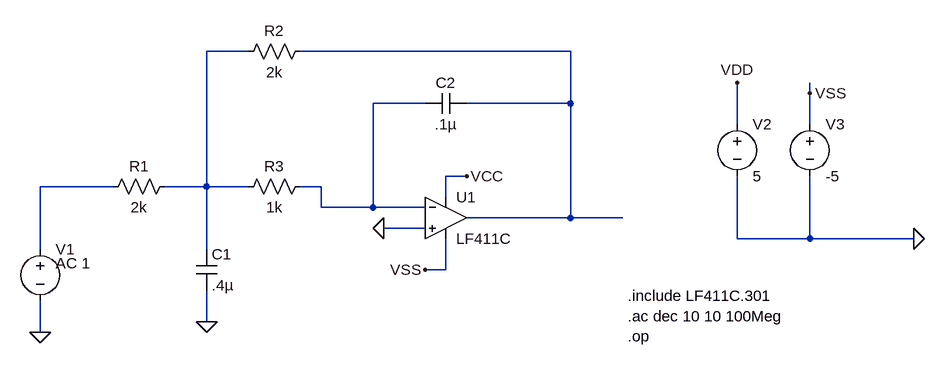
[diagram p0: schematic Draft15.asc]
Draft15.asc, the LTspice schematic file:
Version 4
SHEET 1 1120 680
WIRE 80 96 16 96
WIRE 576 96 160 96
WIRE 944 160 944 144
WIRE 352 176 272 176
WIRE 576 176 576 96
WIRE 576 176 416 176
WIRE 832 208 832 144
WIRE 944 208 944 160
WIRE 416 288 384 288
WIRE -128 304 -240 304
WIRE 16 304 16 96
WIRE 16 304 -48 304
WIRE 80 304 16 304
WIRE 192 304 160 304
WIRE 384 320 384 288
WIRE 192 336 192 304
WIRE 272 336 272 176
WIRE 272 336 192 336
WIRE 352 336 272 336
WIRE 576 352 576 176
WIRE 576 352 416 352
WIRE 656 352 576 352
WIRE 352 368 288 368
WIRE 832 384 832 288
WIRE 944 384 944 288
WIRE 944 384 832 384
WIRE 1104 384 944 384
WIRE -240 400 -240 304
WIRE 16 400 16 304
WIRE 384 432 384 384
WIRE 384 432 352 432
WIRE 16 512 16 464
WIRE -240 528 -240 480
FLAG 416 288 VCC
FLAG 352 432 VSS
FLAG 16 512 0
FLAG -240 528 0
FLAG 288 368 0
FLAG 944 160 VSS
FLAG 832 144 VDD
FLAG 1104 384 0
SYMBOL voltage -240 384 R0
WINDOW 123 24 38 Left 2
SYMATTR InstName V1
SYMATTR Value ""
SYMATTR Value2 AC 1
SYMBOL res -32 288 R90
WINDOW 0 0 56 VBottom 2
WINDOW 3 32 56 VTop 2
SYMATTR InstName R1
SYMATTR Value 2k
SYMBOL res 176 80 R90
WINDOW 0 0 56 VBottom 2
WINDOW 3 32 56 VTop 2
SYMATTR InstName R2
SYMATTR Value 2k
SYMBOL res 176 288 R90
WINDOW 0 0 56 VBottom 2
WINDOW 3 32 56 VTop 2
SYMATTR InstName R3
SYMATTR Value 1k
SYMBOL cap 0 400 R0
SYMATTR InstName C1
SYMATTR Value .4µ
SYMBOL cap 416 160 R90
WINDOW 0 0 32 VBottom 2
WINDOW 3 32 32 VTop 2
SYMATTR InstName C2
SYMATTR Value .1µ
SYMBOL OpAmps/opamp2 384 288 R0
SYMATTR InstName U1
SYMATTR Value LF411C
SYMBOL voltage 832 192 R0
SYMATTR InstName V2
SYMATTR Value 5
SYMBOL voltage 944 192 R0
SYMATTR InstName V3
SYMATTR Value -5
TEXT 664 472 Left 2 !.include LF411C.301\n.ac dec 10 10 100Meg\n.op

The netlist it stands for:
* Draft15.asc
V1 N004 0 AC 1
R1 N001 N004 2k
R2 N002 N001 2k
R3 N003 N001 1k
C1 N001 0 .4µ
C2 N002 N003 .1µ
XU1 0 N003 VCC VSS N002 LF411C  ; pins In+ In- V+ V- OUT
V2 VDD 0 5
V3 VSS 0 -5
.include LF411C.301
.ac dec 10 10 100Meg
.op
.backanno
.end